# Altium schematic sheet 1_z003.schdoc
size 406 x 294 mm; Symbol: Altium_A3; Device: Altium_A3
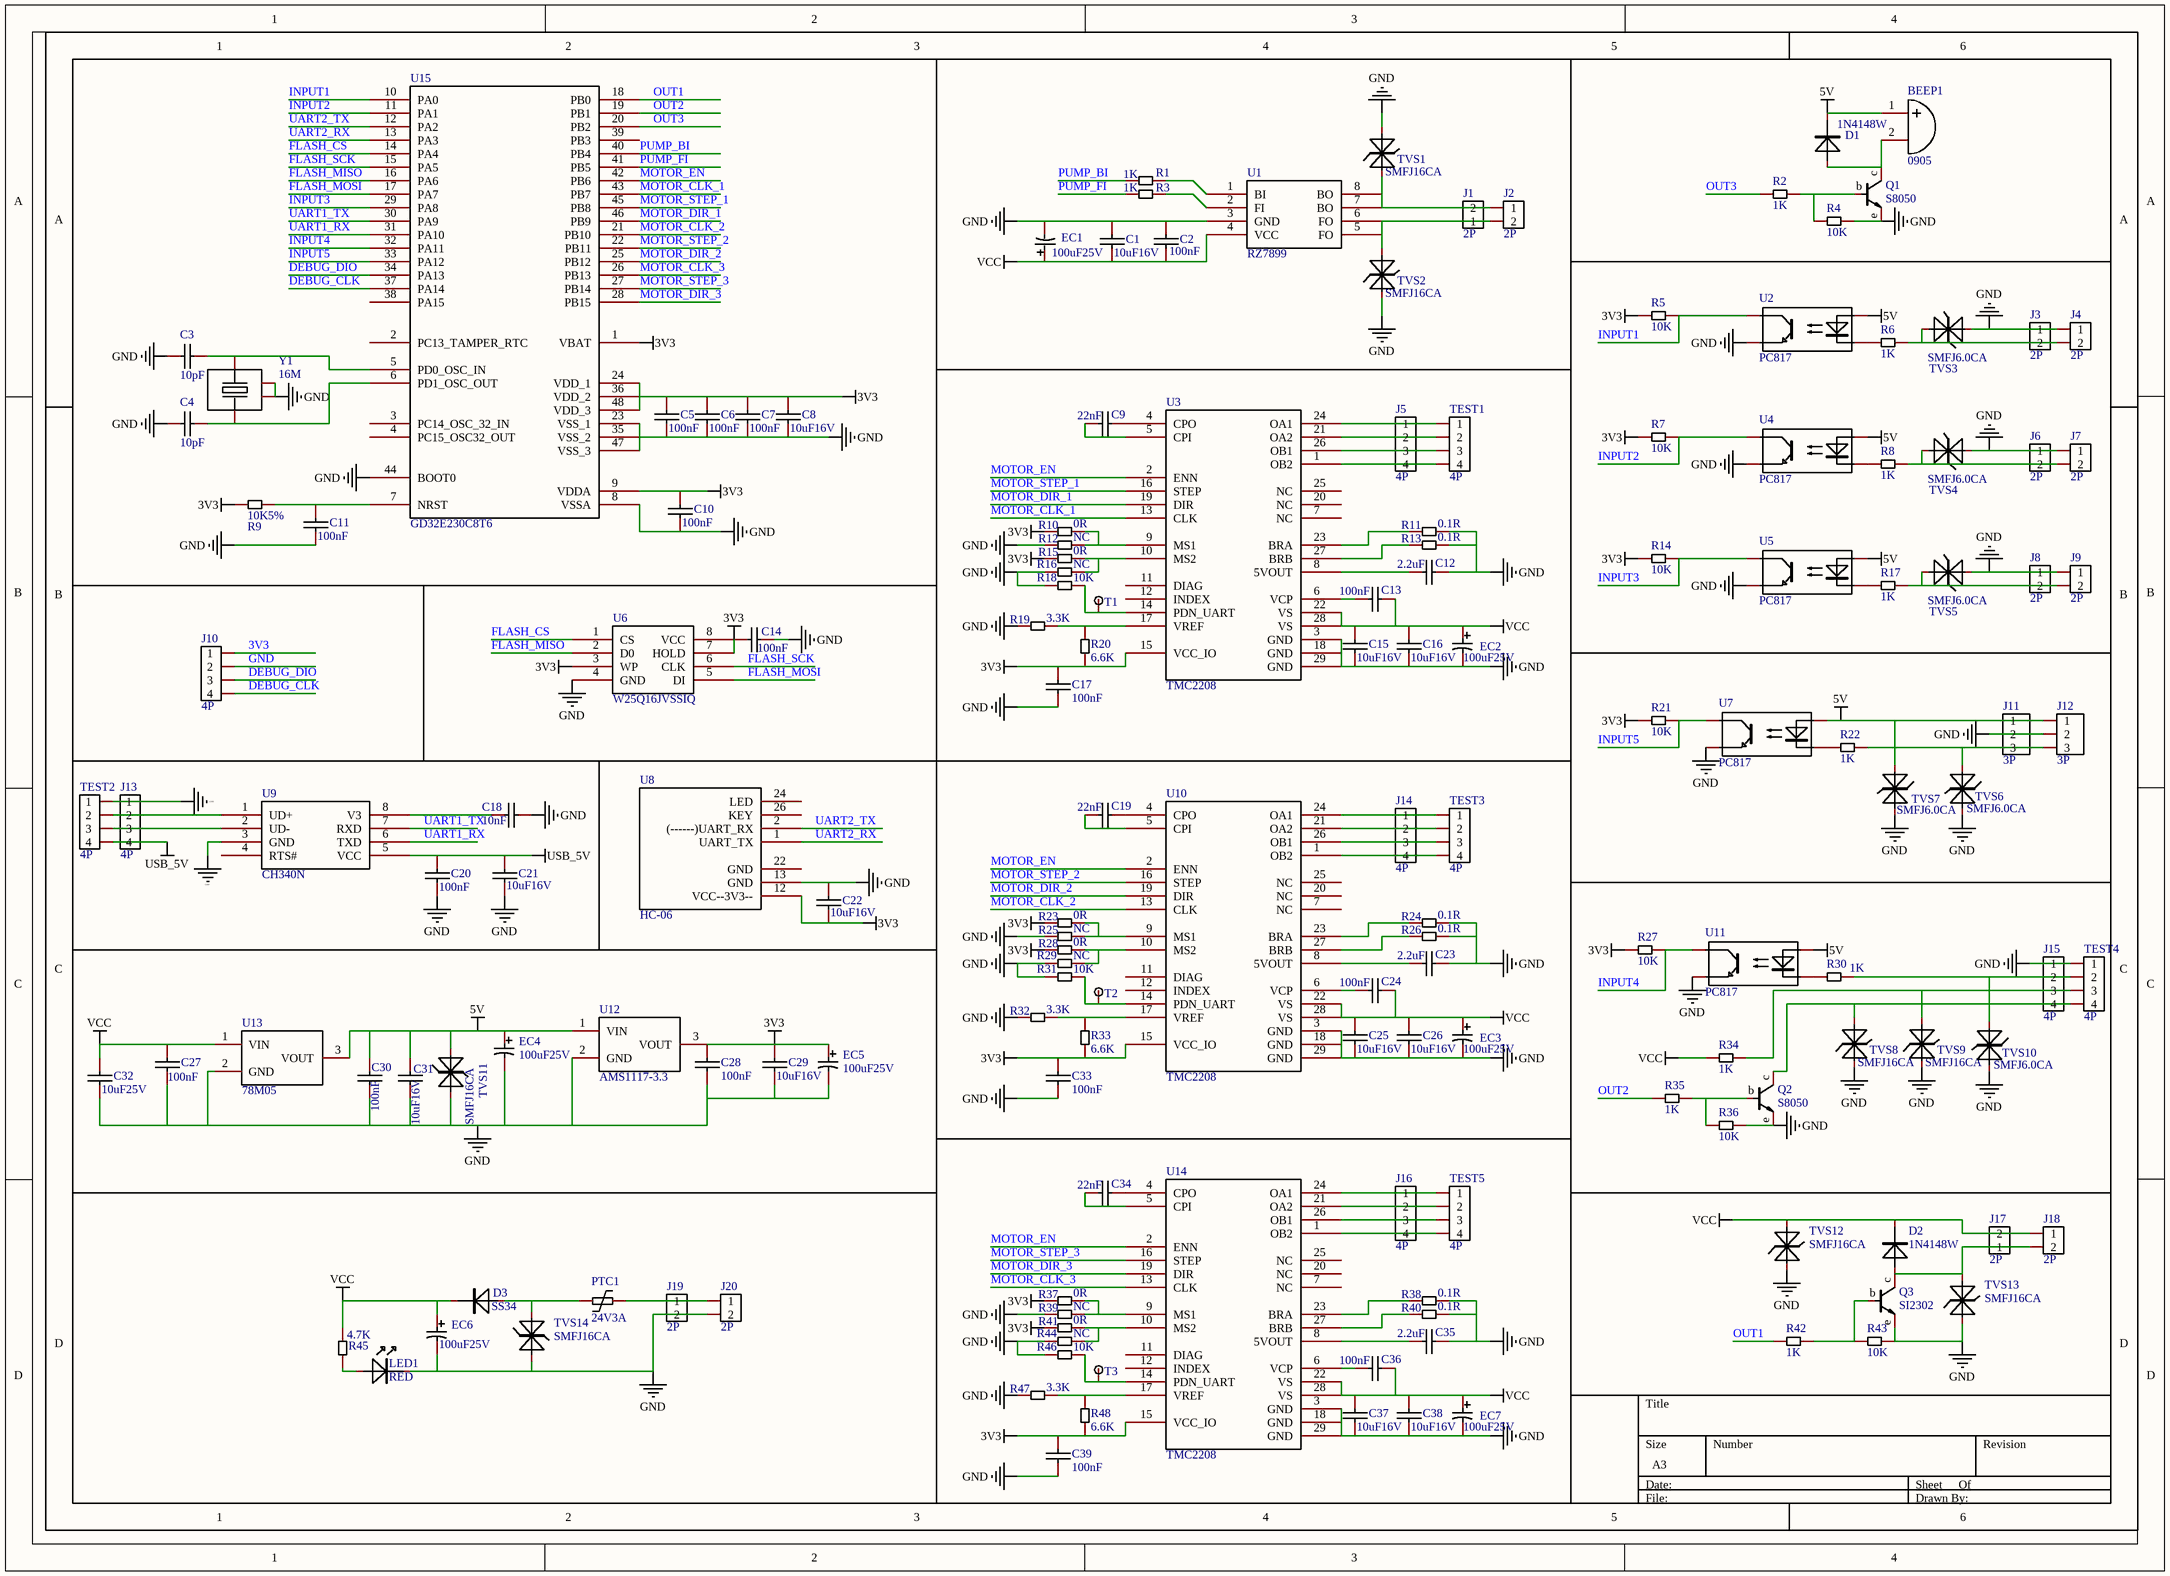
[diagram p0: 1_z003.schdoc]

## Parts
BEEP1  0905  [Դ 9*5mm]
C1  10uF16V  [0603C]
C2  100nF  [0603C]
C3  10pF  [0603C]
C4  10pF  [0603C]
C5  100nF  [0603C]
C6  100nF  [0603C]
C7  100nF  [0603C]
C8  10uF16V  [0603C]
C9  22nF  [0603C]
C10  100nF  [0603C]
C11  100nF  [0603C]
C12  2.2uF  [0603C]
C13  100nF  [0603C]
C14  100nF  [0603C]
C15  10uF16V  [0603C]
C16  10uF16V  [0603C]
C17  100nF  [0603C]
C18  10nF  [0603C]
C19  22nF  [0603C]
C20  100nF  [0603C]
C21  10uF16V  [0603C]
C22  10uF16V  [0603C]
C23  2.2uF  [0603C]
C24  100nF  [0603C]
C25  10uF16V  [0603C]
C26  10uF16V  [0603C]
C27  100nF  [0603C]
C28  100nF  [0603C]
C29  10uF16V  [0603C]
C30  100nF  [0603C]
C31  10uF16V  [0603C]
C32  10uF25V  [0805C]
C33  100nF  [0603C]
C34  22nF  [0603C]
C35  2.2uF  [0603C]
C36  100nF  [0603C]
C37  10uF16V  [0603C]
C38  10uF16V  [0603C]
C39  100nF  [0603C]
D1  1N4148W  [SOD-123]
D2  1N4148W  [SOD-123]
D3  SS34  [SMC]
EC1  100uF25V  [CAP-6.3*7.7]
EC2  100uF25V  [CAP-6.3*7.7]
EC3  100uF25V  [CAP-6.3*7.7]
EC4  100uF25V  [CAP-6.3*7.7]
EC5  100uF25V  [CAP-6.3*7.7]
EC6  100uF25V  [CAP-6.3*7.7]
EC7  100uF25V  [CAP-6.3*7.7]
J1  2P  [D-2.54-2P-G]
J2  2P  [D-2.54-2P-G]
J3  2P  [D-2.54-2P-G]
J4  2P  [D-2.54-2P-G]
J5  4P  [XH-2.54-4P-SMD-ʽ]
J6  2P  [D-2.54-2P-G]
J7  2P  [D-2.54-2P-G]
J8  2P  [D-2.54-2P-G]
J9  2P  [D-2.54-2P-G]
J10  4P  [XH-2.54-4P-SMD-ʽ]
J11  3P  [XH-2.54-3P-SMD-ʽ]
J12  3P  [XH-2.54-3P-SMD-ʽ]
J13  4P  [XH-2.54-4P-SMD-ʽ]
J14  4P  [XH-2.54-4P-SMD-ʽ]
J15  4P  [XH-2.54-4P-SMD-ʽ]
J16  4P  [XH-2.54-4P-SMD-ʽ]
J17  2P  [D-2.54-2P-G]
J18  2P  [D-2.54-2P-G]
J19  2P  [D-2.54-2P-G]
J20  2P  [D-2.54-2P-G]
LED1  RED  [0603D]
PTC1  24V3A  [1812R]
Q1  S8050  [SOT-23-BJT]
Q2  S8050  [SOT-23-BJT]
Q3  SI2302  [SOT-23-BJT]
R1  1K  [0603R]
R2  1K  [0603R]
R3  1K  [0603R]
R4  10K  [0603R]
R5  10K  [0603R]
R6  1K  [0603R]
R7  10K  [0603R]
R8  1K  [0603R]
R9  10K5%  [0603R]
R10  0R  [0603R]
R11  0.1R  [1206R]
R12  NC  [0603R]
R13  0.1R  [1206R]
R14  10K  [0603R]
R15  0R  [0603R]
R16  NC  [0603R]
R17  1K  [0603R]
R18  10K  [0603R]
R19  3.3K  [0603R]
R20  6.6K  [0603R]
R21  10K  [0603R]
R22  1K  [0603R]
R23  0R  [0603R]
R24  0.1R  [1206R]
R25  NC  [0603R]
R26  0.1R  [1206R]
R27  10K  [0603R]
R28  0R  [0603R]
R29  NC  [0603R]
R30  1K  [0603R]
R31  10K  [0603R]
R32  3.3K  [0603R]
R33  6.6K  [0603R]
R34  1K  [0603R]
R35  1K  [0603R]
R36  10K  [0603R]
R37  0R  [0603R]
R38  0.1R  [1206R]
R39  NC  [0603R]
R40  0.1R  [1206R]
R41  0R  [0603R]
R42  1K  [0603R]
R43  10K  [0603R]
R44  NC  [0603R]
R45  4.7K  [0603R]
R46  10K  [0603R]
R47  3.3K  [0603R]
R48  6.6K  [0603R]
T1  测试点  [Ե]  (value not drawn)
T2  测试点  [Ե]  (value not drawn)
T3  测试点  [Ե]  (value not drawn)
TEST1  4P  [XH-2.54-4P-SMD-ʽ]
TEST2  4P  [XH-2.54-4P-SMD-ʽ]
TEST3  4P  [XH-2.54-4P-SMD-ʽ]
TEST4  4P  [XH-2.54-4P-SMD-ʽ]
TEST5  4P  [XH-2.54-4P-SMD-ʽ]
TVS1  SMFJ16CA  [SOD-123]
TVS2  SMFJ16CA  [SOD-123]
TVS3  SMFJ6.0CA  [SOD-123]
TVS4  SMFJ6.0CA  [SOD-123]
TVS5  SMFJ6.0CA  [SOD-123]
TVS6  SMFJ6.0CA  [SOD-123]
TVS7  SMFJ6.0CA  [SOD-123]
TVS8  SMFJ16CA  [SOD-123]
TVS9  SMFJ16CA  [SOD-123]
TVS10  SMFJ6.0CA  [SOD-123]
TVS11  SMFJ16CA  [SOD-123]
TVS12  SMFJ16CA  [SOD-123]
TVS13  SMFJ16CA  [SOD-123]
TVS14  SMFJ16CA  [SOD-123]
U1  RZ7899  [SOP-8]
U2  PC817  [DIP-4-SMD]
U3  TMC2208  [QFN-28]
U4  PC817  [DIP-4-SMD]
U5  PC817  [DIP-4-SMD]
U6  W25Q16JVSSIQ  [SOIC-8]
U7  PC817  [DIP-4-SMD]
U8  HC-06  [HC-06]
U9  CH340N  [SOP-8]
U10  TMC2208  [QFN-28]
U11  PC817  [DIP-4-SMD]
U12  AMS1117-3.3  [SOT-223-4]
U13  78M05  [TO-252]
U14  TMC2208  [QFN-28]
U15  GD32E230C8T6  [LQFP-48]
Y1  16M  [XTAL-3225-4P]

## Nets
3V3: C5.2 C6.2 C7.2 C8.2 C10.2 C14.2 C17.1 C22.1 C28.1 C29.2 C33.1 C39.1 EC5.1 J10.1 R5.2 R7.2 R9.2 R10.2 R14.2 R15.2 R20.2 R21.2 R23.2 R27.2 R28.2 R33.2 R37.2 R41.2 R48.2 U3.15(VCC_IO) U6.3(WP) U6.7(HOLD) U6.8(VCC) U8.12(VCC--3V3--) U10.15(VCC_IO) U12.3(VOUT) U14.15(VCC_IO) U15.1(VBAT) U15.9(VDDA) U15.24(VDD_1) U15.36(VDD_2) U15.48(VDD_3)
5V: BEEP1.1 C30.1 C31.2 D1.2(K) EC4.1 J11.1 J12.1 TVS7.2(K) TVS11.2(K) U2.1(LED_Anode) U4.1(LED_Anode) U5.1(LED_Anode) U7.1(LED_Anode) U11.1(LED_Anode) U12.1(VIN) U13.3(VOUT)
GND: C1.2 C2.1 C3.2 C4.2 C5.1 C6.1 C7.1 C8.1 C10.1 C11.1 C12.1 C14.1 C15.1 C16.1 C17.2 C18.1 C20.1 C21.1 C22.2 C23.1 C25.1 C26.1 C27.2 C28.2 C29.1 C30.2 C31.1 C32.1 C33.2 C35.1 C37.1 C38.1 C39.2 EC1.2 EC2.2 EC3.2 EC4.2 EC5.2 EC6.2 EC7.2 J3.1 J4.1 J6.1 J7.1 J8.1 J9.1 J10.2 J11.2 J12.2 J13.1 J15.1 J19.2 J20.2 LED1.2 Q1.e Q2.e Q3.e R4.1 R11.1 R12.2 R13.1 R16.2 R18.2 R19.2 R24.1 R25.2 R26.1 R29.2 R31.2 R32.2 R36.1 R38.1 R39.2 R40.1 R43.1 R44.2 R46.2 R47.2 TEST2.1 TEST4.1 TVS1.1(A) TVS2.2(K) TVS3.2(K) TVS4.2(K) TVS5.2(K) TVS6.1(A) TVS7.1(A) TVS8.2(K) TVS9.2(K) TVS10.1(A) TVS11.1(A) TVS12.2(K) TVS13.2(K) TVS14.1(A) U1.3(GND) U2.3(Emitter) U3.3(GND) U3.18(GND) U3.29(GND) U4.3(Emitter) U5.3(Emitter) U6.4(GND) U7.3(Emitter) U8.13(GND) U9.3(GND) U10.3(GND) U10.18(GND) U10.29(GND) U11.3(Emitter) U12.2(GND) U13.2(GND) U14.3(GND) U14.18(GND) U14.29(GND) U15.8(VSSA) U15.23(VSS_1) U15.35(VSS_2) U15.44(BOOT0) U15.47(VSS_3) Y1.2 Y1.4
USB_5V: C20.2 C21.2 J13.4 TEST2.4 U9.5(VCC)
VCC: C1.1 C2.2 C13.1 C15.2 C16.2 C24.1 C25.2 C26.2 C27.1 C32.2 C36.1 C37.2 C38.2 D2.2(K) D3.2(K) EC1.1 EC2.1 EC3.1 EC6.1 EC7.1 J17.2 J18.1 R34.2 R45.2 TVS12.1(A) U1.4(VCC) U3.22(VS) U3.28(VS) U10.22(VS) U10.28(VS) U13.1(VIN) U14.22(VS) U14.28(VS)
DEBUG_CLK: J10.4 U15.37(PA14)
DEBUG_DIO: J10.3 U15.34(PA13)
FLASH_CS: U6.1(CS) U15.14(PA4)
FLASH_MISO: U6.2(D0) U15.16(PA6)
FLASH_MOSI: U6.5(DI) U15.17(PA7)
FLASH_SCK: U6.6(CLK) U15.15(PA5)
INPUT1: R5.1 U2.4(Collector) U15.10(PA0)
INPUT2: R7.1 U4.4(Collector) U15.11(PA1)
INPUT3: R14.1 U5.4(Collector) U15.29(PA8)
INPUT4: R27.1 U11.4(Collector) U15.32(PA11)
INPUT5: R21.1 U7.4(Collector) U15.33(PA12)
MOTOR_CLK_1: U3.13(CLK) U15.43(PB7)
MOTOR_CLK_2: U10.13(CLK) U15.21(PB10)
MOTOR_CLK_3: U14.13(CLK) U15.26(PB13)
MOTOR_DIR_1: U3.19(DIR) U15.46(PB9)
MOTOR_DIR_2: U10.19(DIR) U15.25(PB12)
MOTOR_DIR_3: U14.19(DIR) U15.28(PB15)
MOTOR_EN: U3.2(ENN) U10.2(ENN) U14.2(ENN) U15.42(PB6)
MOTOR_STEP_1: U3.16(STEP) U15.45(PB8)
MOTOR_STEP_2: U10.16(STEP) U15.22(PB11)
MOTOR_STEP_3: U14.16(STEP) U15.27(PB14)
OUT1: R42.2 U15.18(PB0)
OUT2: R35.2 U15.19(PB1)
OUT3: R2.2 U15.20(PB2)
PUMP_BI: R1.1 U15.40(PB4)
PUMP_FI: R3.1 U15.41(PB5)
UART1_RX: U9.6(TXD) U15.31(PA10)
UART1_TX: U9.7(RXD) U15.30(PA9)
UART2_RX: U8.1(UART_TX) U15.13(PA3)
UART2_TX: U8.2((------)UART_RX) U15.12(PA2)
NetBEEP1_2: BEEP1.2 D1.1(A) Q1.c
NetC3_1: C3.1 U15.5(PD0_OSC_IN) Y1.1
NetC4_1: C4.1 U15.6(PD1_OSC_OUT) Y1.3
NetC9_1: C9.1 U3.4(CPO)
NetC9_2: C9.2 U3.5(CPI)
NetC11_2: C11.2 R9.1 U15.7(NRST)
NetC12_2: C12.2 U3.8(5VOUT)
NetC13_2: C13.2 U3.6(VCP)
NetC18_2: C18.2 U9.8(V3)
NetC19_1: C19.1 U10.4(CPO)
NetC19_2: C19.2 U10.5(CPI)
NetC23_2: C23.2 U10.8(5VOUT)
NetC24_2: C24.2 U10.6(VCP)
NetC34_1: C34.1 U14.4(CPO)
NetC34_2: C34.2 U14.5(CPI)
NetC35_2: C35.2 U14.8(5VOUT)
NetC36_2: C36.2 U14.6(VCP)
NetD2_1: D2.1(A) J17.1 J18.2 Q3.c TVS13.1(A)
NetD3_1: D3.1(A) PTC1.2 TVS14.2(K)
NetJ1_1: J1.1 J2.2 TVS2.1(A) U1.5(FO) U1.6(FO)
NetJ1_2: J1.2 J2.1 TVS1.2(K) U1.7(BO) U1.8(BO)
NetJ3_2: J3.2 J4.2 R6.1 TVS3.1(A)
NetJ5_1: J5.1 TEST1.1 U3.24(OA1)
NetJ5_2: J5.2 TEST1.2 U3.21(OA2)
NetJ5_3: J5.3 TEST1.3 U3.26(OB1)
NetJ5_4: J5.4 TEST1.4 U3.1(OB2)
NetJ6_2: J6.2 J7.2 R8.1 TVS4.1(A)
NetJ8_2: J8.2 J9.2 R17.1 TVS5.1(A)
NetJ11_3: J11.3 J12.3 R22.1 TVS6.2(K)
NetJ13_2: J13.2 TEST2.2 U9.1(UD+)
NetJ13_3: J13.3 TEST2.3 U9.2(UD-)
NetJ14_1: J14.1 TEST3.1 U10.24(OA1)
NetJ14_2: J14.2 TEST3.2 U10.21(OA2)
NetJ14_3: J14.3 TEST3.3 U10.26(OB1)
NetJ14_4: J14.4 TEST3.4 U10.1(OB2)
NetJ15_2: J15.2 R30.1 TEST4.2 TVS10.2(K)
NetJ15_3: J15.3 R34.1 TEST4.3 TVS9.1(A)
NetJ15_4: J15.4 Q2.c TEST4.4 TVS8.1(A)
NetJ16_1: J16.1 TEST5.1 U14.24(OA1)
NetJ16_2: J16.2 TEST5.2 U14.21(OA2)
NetJ16_3: J16.3 TEST5.3 U14.26(OB1)
NetJ16_4: J16.4 TEST5.4 U14.1(OB2)
NetJ19_1: J19.1 J20.1 PTC1.1
NetLED1_1: LED1.1 R45.1
NetQ1_b: Q1.b R2.1 R4.2
NetQ2_b: Q2.b R35.1 R36.2
NetQ3_b: Q3.b R42.1 R43.2
NetR1_2: R1.2 U1.1(BI)
NetR3_2: R3.2 U1.2(FI)
NetR6_2: R6.2 U2.2(LED_Cathode)
NetR8_2: R8.2 U4.2(LED_Cathode)
NetR10_1: R10.1 R12.1 U3.9(MS1)
NetR11_2: R11.2 U3.23(BRA)
NetR13_2: R13.2 U3.27(BRB)
NetR15_1: R15.1 R16.1 U3.10(MS2)
NetR17_2: R17.2 U5.2(LED_Cathode)
NetR18_1: R18.1 T1.1 U3.14(PDN_UART)
NetR19_1: R19.1 R20.1 U3.17(VREF)
NetR22_2: R22.2 U7.2(LED_Cathode)
NetR23_1: R23.1 R25.1 U10.9(MS1)
NetR24_2: R24.2 U10.23(BRA)
NetR26_2: R26.2 U10.27(BRB)
NetR28_1: R28.1 R29.1 U10.10(MS2)
NetR30_2: R30.2 U11.2(LED_Cathode)
NetR31_1: R31.1 T2.1 U10.14(PDN_UART)
NetR32_1: R32.1 R33.1 U10.17(VREF)
NetR37_1: R37.1 R39.1 U14.9(MS1)
NetR38_2: R38.2 U14.23(BRA)
NetR40_2: R40.2 U14.27(BRB)
NetR41_1: R41.1 R44.1 U14.10(MS2)
NetR46_1: R46.1 T3.1 U14.14(PDN_UART)
NetR47_1: R47.1 R48.1 U14.17(VREF)

Not connected (* = marked no-connect by the designer): U3 7(NC) 11(DIAG) 12(INDEX) 20(NC) 25(NC); U8 22(GND) 24(LED) 26(KEY); U9 4(RTS#); U10 7(NC) 11(DIAG) 12(INDEX) 20(NC) 25(NC); U14 7(NC) 11(DIAG) 12(INDEX) 20(NC) 25(NC); U15 2(PC13_TAMPER_RTC) 3(PC14_OSC_32_IN) 4(PC15_OSC32_OUT) 38(PA15) 39(PB3)

## Notes on the sheet
- 1
- 2
- 3
- 4
- 5
- 6
- A
- B
- C
- D
- Title
- Size
- A3
- Number
- Revision
- File:
- Date:
- Drawn By:
- Sheet
- Of

## Library data of the parts
BEEP1 = 0905: Symbol: autoName_994cb5eb6fb58144; Origin Footprint 2: __Դ______-SMD-4*4; Origin Footprint 3: ______-SMD-4*4; Origin Footprint 4: ______-SMD-9.6*9.6*5; Add into BOM: yes; Origin Footprint 1: __Դ______ 9*5mm; Name: 0905; Device: 0905; Convert to PCB: yes; Design Item ID: ------; Library Name: -ǳ---Ԫ--
C1 C8 C15 C16 C25 C26 C29 C31 C37 C38 = 10uF16V: CAP-50V-X7R; Symbol: -޼-2P; Origin Footprint 2: 0805C; Origin Footprint 3: 0402C; Origin Footprint 4: 0201C; Origin Footprint 5: 1206C; Origin Footprint 6: 1210C; Origin Footprint 7: 1812C; Origin Footprint 8: 2010C; Origin Footprint 9: 2512C; Origin Footprint 10: CBB W=11.5 T=5 P=10; Origin Footprint 11: Y TYPE CAP D=10mm; Add into BOM: yes; Name: 10uF16V; Device: 10uF16V; Convert to PCB: yes; Origin Footprint 1: 0603C; Design Item ID: ------޼----2P; Library Name: ----Ԫ--
C2 C5-C7 C10 C11 C13 C14 C17 C20 C24 C27 C28 C30 C33 C36 C39 = 100nF: CAP-50V-X7R; Symbol: -޼-2P; Origin Footprint 2: 0805C; Origin Footprint 3: 0402C; Origin Footprint 4: 0201C; Origin Footprint 5: 1206C; Origin Footprint 6: 1210C; Origin Footprint 7: 1812C; Origin Footprint 8: 2010C; Origin Footprint 9: 2512C; Add into BOM: yes; Name: 100nF; Device: 100nF; Convert to PCB: yes; Origin Footprint 1: 0603C; Design Item ID: ------޼----2P; Library Name: ----Ԫ--
  C27 C28 C30: _ͺ_: *; ____: *
C3 C4 = 10pF: CAP-50V-X7R; Symbol: -޼-2P; Origin Footprint 2: 0805C; Origin Footprint 3: 0402C; Origin Footprint 4: 0201C; Origin Footprint 5: 1206C; Origin Footprint 6: 1210C; Origin Footprint 7: 1812C; Origin Footprint 8: 2010C; Origin Footprint 9: 2512C; Add into BOM: yes; Name: 10pF; Device: 10pF; Convert to PCB: yes; Origin Footprint 1: 0603C; Design Item ID: ------޼----2P; Library Name: ----Ԫ--
C9 C19 C34 = 22nF: CAP-50V-X7R; Symbol: -޼-2P; Origin Footprint 2: 0805C; Origin Footprint 3: 0402C; Origin Footprint 4: 0201C; Origin Footprint 5: 1206C; Origin Footprint 6: 1210C; Origin Footprint 7: 1812C; Origin Footprint 8: 2010C; Origin Footprint 9: 2512C; Add into BOM: yes; Name: 22nF; Device: 22nF; Convert to PCB: yes; Origin Footprint 1: 0603C; Design Item ID: ------޼----2P; Library Name: ----Ԫ--
C12 C23 C35 = 2.2uF: CAP-50V-X7R; Symbol: -޼-2P; Origin Footprint 2: 0805C; Origin Footprint 3: 0402C; Origin Footprint 4: 0201C; Origin Footprint 5: 1206C; Origin Footprint 6: 1210C; Origin Footprint 7: 1812C; Origin Footprint 8: 2010C; Origin Footprint 9: 2512C; Add into BOM: yes; Name: 2.2uF; Device: 2.2uF; Convert to PCB: yes; Origin Footprint 1: 0603C; Design Item ID: ------޼----2P; Library Name: ----Ԫ--
C18 = 10nF: CAP-50V-X7R; Symbol: -޼-2P; Origin Footprint 2: 0805C; Origin Footprint 3: 0402C; Origin Footprint 4: 0201C; Origin Footprint 5: 1206C; Origin Footprint 6: 1210C; Origin Footprint 7: 1812C; Origin Footprint 8: 2010C; Origin Footprint 9: 2512C; Add into BOM: yes; Name: 10nF; Device: 10nF; Convert to PCB: yes; Origin Footprint 1: 0603C; Design Item ID: ------޼----2P; Library Name: ----Ԫ--
C21 C22 = 10uF16V: Symbol: -޼-2P; Origin Footprint 2: 0805C; Origin Footprint 3: 0402C; Origin Footprint 4: 0201C; Origin Footprint 5: 1206C; Origin Footprint 6: 1210C; Origin Footprint 7: 1812C; Origin Footprint 8: 2010C; Origin Footprint 9: 2512C; Origin Footprint 10: CBB W=11.5 T=5 P=10; Origin Footprint 11: Y TYPE CAP D=10mm; Add into BOM: yes; Name: 10uF16V; Device: 10uF16V; Convert to PCB: yes; Origin Footprint 1: 0603C; Design Item ID: ------޼----2P; Library Name: ----Ԫ--
C32 = 10uF25V: CAP-50V-X7R; Symbol: -޼-2P; Origin Footprint 2: 0603C; Origin Footprint 3: 0402C; Origin Footprint 4: 0201C; Origin Footprint 5: 1206C; Origin Footprint 6: 1210C; Origin Footprint 7: 1812C; Origin Footprint 8: 2010C; Origin Footprint 9: 2512C; Add into BOM: yes; Name: 10uF25V; Device: 10uF25V; Convert to PCB: yes; Origin Footprint 1: 0805C; Design Item ID: ------޼----2P; Library Name: ----Ԫ--
D1 D2 = 1N4148W: Symbol: -ͨ-2P; Origin Footprint 2: 1206D; Origin Footprint 3: SMA; Origin Footprint 4: SMB; Origin Footprint 5: SMC; Origin Footprint 6: TO-277; Origin Footprint 7: 0805D; Origin Footprint 8: SOD-923; Origin Footprint 9: LL34; Add into BOM: yes; Name: 1N4148W; Device: 1N4148W; Convert to PCB: yes; Origin Footprint 1: SOD-123; Design Item ID: ---------ͨ-2P; Library Name: ----Ԫ--
D3 = SS34: Symbol: -ͨ-2P; Origin Footprint 2: 1206D; Origin Footprint 3: SMA; Origin Footprint 4: SMB; Origin Footprint 5: TO-277; Origin Footprint 6: 0805D; Origin Footprint 7: SOD-123; Add into BOM: yes; Name: SS34; Device: SS34; Convert to PCB: yes; Origin Footprint 1: SMC; Design Item ID: ---------ͨ-2P; Library Name: ----Ԫ--
EC1-EC7 = 100uF25V: Symbol: -Ե-2P; Origin Footprint 2: CAP-10*12.6; Origin Footprint 3: CAP-8.0*6.9; Origin Footprint 4: CAP-4.0*5.4; Origin Footprint 5: XH414H-IV01E; Origin Footprint 6: CAP_DIP_5*11; Origin Footprint 7: CAP_DIP_6.3*11; Origin Footprint 8: CAP_DIP_8*12; Origin Footprint 9: CAP_DIP_10*16; Origin Footprint 10: CAP_DIP_10*20; Origin Footprint 11: CAP_DIP_12.5*20; Origin Footprint 12: CAP_DIP_12.5*25; Origin Footprint 13: CAP_DIP_12.5*30; Origin Footprint 14: CAP_DIP_16*25; Origin Footprint 15: CAP_DIP_16*30; Origin Footprint 16: CAP_DIP_16*35; Origin Footprint 17: CAP_DIP_16*40; Origin Footprint 18: CAP_DIP_18*35; Origin Footprint 19: CAP_DIP_18*40; Origin Footprint 20: CAP_DIP_18*45; Origin Footprint 21: CAP-5.0*5.9; Origin Footprint 22: TA; Origin Footprint 23: TB; Origin Footprint 24: TC; Origin Footprint 25: TD; Origin Footprint 26: TP; Origin Footprint 27: CAP_DIP_30*35; Add into BOM: yes; Name: 100uF25V; Device: 100uF25V; Convert to PCB: yes; Origin Footprint 1: CAP-6.3*7.7; Design Item ID: --------Ե----2P; Library Name: ----Ԫ--
J1 J3 J6 J8 J17 J19 = 2P: Origin Footprint 2: HT5.08-2P; Origin Footprint 4: 5.08-2P; Origin Footprint 5: XH-2.54-2P; Origin Footprint 6: HX-PT-2.0-2P; Origin Footprint 7: XT-60-M; Origin Footprint 8: XT-60-G; Origin Footprint 9: SMD-1.25mm-2P; Origin Footprint 10: SH1.0-2P-____; Origin Footprint 11: PH-2.0-2P-____; Origin Footprint 12: PH-2.0-2P-ֱ__; Origin Footprint 13: VH-7.92-2P; Origin Footprint 14: D-2.0-2P-G; Origin Footprint 15: MAX3.96-2P; Add into BOM: yes; Origin Footprint 1: XH-2.54-2P-SMD-__ʽ; Name: 2P; Symbol: 2P; Device: 2P; Origin Footprint 3: D-2.54-2P-G; Convert to PCB: yes; Design Item ID: 2P; Library Name: ----
J2 J4 J7 J9 J18 J20 = 2P: Origin Footprint 2: HT5.08-2P; Origin Footprint 3: 5.08-2P; Origin Footprint 4: XH-2.54-2P; Origin Footprint 5: HX-PT-2.0-2P; Origin Footprint 6: XT-60-M; Origin Footprint 7: XT-60-G; Origin Footprint 8: SMD-1.25mm-2P; Origin Footprint 9: XH-2.54-2P-SMD-__ʽ; Origin Footprint 10: SH1.0-2P-____; Origin Footprint 11: PH-2.0-2P-____; Origin Footprint 12: PH-2.0-2P-ֱ__; Origin Footprint 13: VH-7.92-2P; Origin Footprint 14: D-2.0-2P-G; Origin Footprint 15: MAX3.96-2P; Add into BOM: yes; Name: 2P; Symbol: 2P; Device: 2P; Convert to PCB: yes; Origin Footprint 1: D-2.54-2P-G; Design Item ID: 2P; Library Name: ----
J5 J13-J16 = 4P: Origin Footprint 2: D-2.54-4P-G; Origin Footprint 3: 5.08-4P; Origin Footprint 4: XH-2.54-4P; Origin Footprint 5: HT5.08-4P; Origin Footprint 6: HT5.08-4P-GD; Origin Footprint 7: HX-PT-2.0-4P; Origin Footprint 8: SH1.0_4P___ʽ; Origin Footprint 9: D-2.0-4P-G; Origin Footprint 10: SH1.0-4P-____; Origin Footprint 11: FFC-1.25-4P; Origin Footprint 12: PH-2.0-4P-____; Origin Footprint 13: PH-2.0-4P-ֱ__; Origin Footprint 14: VH-3.96-4P; Origin Footprint 15: ̽__-SMD-4P; Add into BOM: yes; Origin Footprint 1: XH-2.54-4P-SMD-__ʽ; Name: 4P; Symbol: 4P; Device: 4P; Convert to PCB: yes; Design Item ID: 4P; Library Name: ----
J10 TEST1-TEST5 = 4P: Origin Footprint 2: 5.08-4P; Origin Footprint 3: XH-2.54-4P; Origin Footprint 4: HT5.08-4P; Origin Footprint 5: HT5.08-4P-GD; Origin Footprint 6: HX-PT-2.0-4P; Origin Footprint 7: SH1.0_4P___ʽ; Origin Footprint 8: XH-2.54-4P-SMD-__ʽ; Origin Footprint 9: D-2.0-4P-G; Origin Footprint 10: SH1.0-4P-____; Origin Footprint 11: FFC-1.25-4P; Origin Footprint 12: PH-2.0-4P-____; Origin Footprint 13: PH-2.0-4P-ֱ__; Origin Footprint 14: VH-3.96-4P; Origin Footprint 15: ̽__-SMD-4P; Add into BOM: yes; Origin Footprint 1: D-2.54-4P-G; Name: 4P; Symbol: 4P; Device: 4P; Convert to PCB: yes; Design Item ID: 4P; Library Name: ----
J11 = 3P: Origin Footprint 2: HT5.08-3P; Origin Footprint 3: D-2.54-3P-G; Origin Footprint 4: 5.08-3P; Origin Footprint 5: XH-2.54-3P; Origin Footprint 6: HX-PT-2.0-3P; Origin Footprint 7: FFC-1.25-3P; Origin Footprint 8: VH-7.92-3P; Origin Footprint 9: PH-2.0-3P-ֱ__; Origin Footprint 10: SH1.0-3P-____; Origin Footprint 11: VH-3.96-3P; Add into BOM: yes; Origin Footprint 1: XH-2.54-3P-SMD-__ʽ; Name: 3P; Symbol: 3P; Device: 3P; Convert to PCB: yes; Design Item ID: 3P; Library Name: ----
J12 = 3P: Origin Footprint 2: HT5.08-3P; Origin Footprint 3: 5.08-3P; Origin Footprint 4: XH-2.54-3P; Origin Footprint 5: HX-PT-2.0-3P; Origin Footprint 6: XH-2.54-3P-SMD-__ʽ; Origin Footprint 7: FFC-1.25-3P; Origin Footprint 8: VH-7.92-3P; Origin Footprint 9: PH-2.0-3P-ֱ__; Origin Footprint 10: SH1.0-3P-____; Origin Footprint 11: VH-3.96-3P; Add into BOM: yes; Origin Footprint 1: D-2.54-3P-G; Name: 3P; Symbol: 3P; Device: 3P; Convert to PCB: yes; Design Item ID: 3P; Library Name: ----
LED1 = RED: Symbol: -LED-2P; Origin Footprint 2: 0805D; Origin Footprint 3: 0603D__ɫ; Origin Footprint 7: 5mm_LED; Origin Footprint 8: 10mm_LED; Origin Footprint 9: 0402D; Origin Footprint 10: 3mm_LED; Add into BOM: yes; Name: RED; Device: RED; Origin Footprint 4: 0603D__ɫ; Origin Footprint 5: 0603D__ɫ; Origin Footprint 6: 0603D__ɫ; Convert to PCB: yes; Origin Footprint 1: 0603D; Design Item ID: -------LED-2P; Library Name: ----Ԫ--
PTC1 = 24V3A: Symbol: ˿-Իָ-2P; Origin Footprint 2: 0805R; Origin Footprint 3: 1206R; Origin Footprint 4: 2010R; Origin Footprint 5: 2012R; Origin Footprint 6: 2512R; Origin Footprint 7: 0603R; Origin Footprint 8: B250-120; Origin Footprint 9: 1210R; Origin Footprint 10: MOV D9; Origin Footprint 11: MOV D5; Origin Footprint 12: MOV D7; Origin Footprint 13: MOV D11; Origin Footprint 14: MOV D13; Origin Footprint 15: MOV D14; Origin Footprint 16: MOV D15; Add into BOM: yes; Name: 24V3A; Device: 24V3A; Convert to PCB: yes; Origin Footprint 1: 1812R; Design Item ID: ----˿--Իָ--2P; Library Name: ----Ԫ--
Q1 Q2 = S8050: Symbol: -NPN-3P; Origin Footprint 2: SOT-89 -BJT; Origin Footprint 3: TO-220-BJT-TP15*10.5*21; Origin Footprint 4: TO-220-BJT; Add into BOM: yes; Name: S8050; Device: S8050; Convert to PCB: yes; Origin Footprint 1: SOT-23-BJT; Design Item ID: -------NPN-3P; Library Name: ----Ԫ--
Q3 = SI2302: Symbol: -NPN-3P; Origin Footprint 2: SOT-89 -BJT; Origin Footprint 3: TO-220-BJT-TP15*10.5*21; Origin Footprint 4: TO-220-BJT; Add into BOM: yes; Name: SI2302; Device: SI2302; Convert to PCB: yes; Origin Footprint 1: SOT-23-BJT; Design Item ID: -------NPN-3P; Library Name: ----Ԫ--
R1 R3 = 1K: RES-1%-RL; Symbol: -ͨ-2P; Origin Footprint 2: 0805R; Origin Footprint 3: 0402R; Origin Footprint 4: 0201R; Origin Footprint 5: 1206R; Origin Footprint 6: 1210R; Origin Footprint 7: 1812R; Origin Footprint 8: 2012R; Origin Footprint 9: 2512R; Add into BOM: yes; Origin Footprint 10: 5930R; Name: 1K; Device: 1K; _ͺ_: *; ____: *; Convert to PCB: yes; Origin Footprint 1: 0603R; Design Item ID: -------ͨ-2P; Library Name: ----Ԫ--
R2 R35 R42 = 1K: RES-1%-RL; Symbol: -ͨ-2P; Origin Footprint 2: 0805R; Origin Footprint 3: 0402R; Origin Footprint 4: 0201R; Origin Footprint 5: 1206R; Origin Footprint 6: 1210R; Origin Footprint 7: 1812R; Origin Footprint 8: 2012R; Origin Footprint 9: 2512R; Add into BOM: yes; Name: 1K; Device: 1K; _ͺ_: *; ____: *; Convert to PCB: yes; Origin Footprint 1: 0603R; Design Item ID: -------ͨ-2P; Library Name: ----Ԫ--
R4 R36 R43 = 10K: RES-1%-RL; Symbol: -ͨ-2P; Origin Footprint 2: 0805R; Origin Footprint 3: 0402R; Origin Footprint 4: 0201R; Origin Footprint 5: 1206R; Origin Footprint 6: 1210R; Origin Footprint 7: 1812R; Origin Footprint 8: 2012R; Origin Footprint 9: 2512R; Add into BOM: yes; Name: 10K; Device: 10K; _ͺ_: *; ____: *; Convert to PCB: yes; Origin Footprint 1: 0603R; Design Item ID: -------ͨ-2P; Library Name: ----Ԫ--
R5 R7 R14 R18 R21 R27 R31 R46 = 10K: --Ƭ----; Symbol: -ͨ-2P; Origin Footprint 2: 0805R; Origin Footprint 3: 0402R; Origin Footprint 4: 0201R; Origin Footprint 5: 1206R; Origin Footprint 6: 1210R; Origin Footprint 7: 1812R; Origin Footprint 8: 2012R; Origin Footprint 9: 2512R; Add into BOM: yes; Name: 10K; Device: 10K; _ͺ_: *; ____: *; Convert to PCB: yes; Origin Footprint 1: 0603R; Design Item ID: -------ͨ-2P; Library Name: ----Ԫ--
R6 R8 R17 R22 R30 R34 = 1K: --Ƭ----; Symbol: -ͨ-2P; Origin Footprint 2: 0805R; Origin Footprint 3: 0402R; Origin Footprint 4: 0201R; Origin Footprint 5: 1206R; Origin Footprint 6: 1210R; Origin Footprint 7: 1812R; Origin Footprint 8: 2012R; Origin Footprint 9: 2512R; Add into BOM: yes; Name: 1K; Device: 1K; _ͺ_: *; ____: *; Convert to PCB: yes; Origin Footprint 1: 0603R; Design Item ID: -------ͨ-2P; Library Name: ----Ԫ--
R9 = 10K5%: RES-1%-RL; Symbol: -ͨ-2P; Origin Footprint 2: 0805R; Origin Footprint 3: 0402R; Origin Footprint 4: 0201R; Origin Footprint 5: 1206R; Origin Footprint 6: 1210R; Origin Footprint 7: 1812R; Origin Footprint 8: 2012R; Origin Footprint 9: 2512R; Add into BOM: yes; Name: 10K5%; Device: 10K5%; Convert to PCB: yes; Origin Footprint 1: 0603R; Design Item ID: -------ͨ-2P; Library Name: ----Ԫ--
R10 R15 R23 R28 R37 R41 = 0R: --Ƭ----; Symbol: -ͨ-2P; Origin Footprint 2: 0805R; Origin Footprint 3: 0402R; Origin Footprint 4: 0201R; Origin Footprint 5: 1206R; Origin Footprint 6: 1210R; Origin Footprint 7: 1812R; Origin Footprint 8: 2012R; Origin Footprint 9: 2512R; Add into BOM: yes; Name: 0R; Device: 0R; _ͺ_: *; ____: *; Convert to PCB: yes; Origin Footprint 1: 0603R; Design Item ID: -------ͨ-2P; Library Name: ----Ԫ--
R11 R13 R24 R26 R38 R40 = 0.1R: --Ƭ----; Symbol: -ͨ-2P; Origin Footprint 2: 0805R; Origin Footprint 3: 0603R; Origin Footprint 4: 0402R; Origin Footprint 5: 0201R; Origin Footprint 6: 1210R; Origin Footprint 7: 1812R; Origin Footprint 8: 2012R; Origin Footprint 9: 2512R; Add into BOM: yes; Name: 0.1R; Device: 0.1R; _ͺ_: *; ____: *; Convert to PCB: yes; Origin Footprint 1: 1206R; Design Item ID: -------ͨ-2P; Library Name: ----Ԫ--
R12 R16 R25 R29 R39 R44 = NC: --Ƭ----; Symbol: -ͨ-2P; Origin Footprint 2: 0805R; Origin Footprint 3: 0402R; Origin Footprint 4: 0201R; Origin Footprint 5: 1206R; Origin Footprint 6: 1210R; Origin Footprint 7: 1812R; Origin Footprint 8: 2012R; Origin Footprint 9: 2512R; Add into BOM: yes; Name: NC; Device: NC; _ͺ_: *; ____: *; Convert to PCB: yes; Origin Footprint 1: 0603R; Design Item ID: -------ͨ-2P; Library Name: ----Ԫ--
R19 R32 R47 = 3.3K: --Ƭ----; Symbol: -ͨ-2P; Origin Footprint 2: 0805R; Origin Footprint 3: 0402R; Origin Footprint 4: 0201R; Origin Footprint 5: 1206R; Origin Footprint 6: 1210R; Origin Footprint 7: 1812R; Origin Footprint 8: 2012R; Origin Footprint 9: 2512R; Add into BOM: yes; Name: 3.3K; Device: 3.3K; _ͺ_: *; ____: *; Convert to PCB: yes; Origin Footprint 1: 0603R; Design Item ID: -------ͨ-2P; Library Name: ----Ԫ--
R20 R33 R48 = 6.6K: --Ƭ----; Symbol: -ͨ-2P; Origin Footprint 2: 0805R; Origin Footprint 3: 0402R; Origin Footprint 4: 0201R; Origin Footprint 5: 1206R; Origin Footprint 6: 1210R; Origin Footprint 7: 1812R; Origin Footprint 8: 2012R; Origin Footprint 9: 2512R; Add into BOM: yes; Name: 6.6K; Device: 6.6K; _ͺ_: *; ____: *; Convert to PCB: yes; Origin Footprint 1: 0603R; Design Item ID: -------ͨ-2P; Library Name: ----Ԫ--
R45 = 4.7K: --Ƭ----; Symbol: -ͨ-2P; Origin Footprint 2: 0805R; Origin Footprint 3: 0402R; Origin Footprint 4: 0201R; Origin Footprint 5: 1206R; Origin Footprint 6: 1210R; Origin Footprint 7: 1812R; Origin Footprint 8: 2012R; Origin Footprint 9: 2512R; Add into BOM: yes; Name: 4.7K; Device: 4.7K; _ͺ_: *; ____: *; Convert to PCB: yes; Origin Footprint 1: 0603R; Design Item ID: -------ͨ-2P; Library Name: ----Ԫ--
T1-T3 = 测试点: Add into BOM: yes; Origin Footprint: ___Ե_; Name: 测试点; Symbol: Ե; Device: 测试点; Convert to PCB: yes; Design Item ID: ---Ե-; Library Name: -ǳ---Ԫ--
TVS1 TVS2 TVS8 TVS9 TVS12 TVS13 = SMFJ16CA: Symbol: -˫TVS-2P; Origin Footprint 2: SMA; Origin Footprint 3: SMB; Origin Footprint 4: SMC; Origin Footprint 5: SOD-923; Origin Footprint 6: 0402R; Origin Footprint 7: 0603R; Add into BOM: yes; Origin Footprint 8: SOD-523; Name: SMFJ16CA; Device: SMFJ16CA; Convert to PCB: yes; Origin Footprint 1: SOD-123; Design Item ID: -------˫--TVS-2P; Library Name: ----Ԫ--
TVS3-TVS7 TVS10 = SMFJ6.0CA: Symbol: -˫TVS-2P; Origin Footprint 2: SMA; Origin Footprint 3: SMB; Origin Footprint 4: SMC; Origin Footprint 5: SOD-923; Origin Footprint 6: 0402R; Origin Footprint 7: 0603R; Origin Footprint 8: SOD-523; Add into BOM: yes; Name: SMFJ6.0CA; Device: SMFJ6.0CA; Convert to PCB: yes; Origin Footprint 1: SOD-123; Design Item ID: -------˫--TVS-2P; Library Name: ----Ԫ--
TVS11 TVS14 = SMFJ16CA: Symbol: -˫TVS-2P; Origin Footprint 2: SMA; Origin Footprint 3: SMB; Origin Footprint 4: SMC; Origin Footprint 5: SOD-923; Origin Footprint 6: 0402R; Origin Footprint 7: 0603R; Add into BOM: yes; Name: SMFJ16CA; Device: SMFJ16CA; Convert to PCB: yes; Origin Footprint 1: SOD-123; Design Item ID: -------˫--TVS-2P; Library Name: ----Ԫ--
U1 = RZ7899: Add into BOM: yes; Name: RZ7899; Symbol: RZ7899; Device: RZ7899; Convert to PCB: yes; Origin Footprint: SOP-8; Design Item ID: RZ7899; Library Name: IC
U2 U4 U5 U7 U11 = PC817: Origin Footprint 2: DIP-4; Add into BOM: yes; Name: PC817; Symbol: PC817; Device: PC817; Convert to PCB: yes; Origin Footprint 1: DIP-4-SMD; Design Item ID: PC817; Library Name: IC
U3 U10 U14 = TMC2208: Add into BOM: yes; Name: TMC2208; Symbol: TMC2208; Device: TMC2208; Convert to PCB: yes; Origin Footprint: QFN-28; Design Item ID: TMC2208; Library Name: IC; NO_CONNECT: yes
U6 = W25Q16JVSSIQ: Symbol: W25QXXXX; Add into BOM: yes; Origin Footprint: SOIC-8 ____; Name: W25Q16JVSSIQ; Device: W25Q16JVSSIQ; Convert to PCB: yes; Design Item ID: W25QXXXX; Library Name: IC
U8 = HC-06: Add into BOM: yes; Name: HC-06; Symbol: HC-06; Device: HC-06; Convert to PCB: yes; Origin Footprint: HC-06; Design Item ID: HC-06; Library Name: -ǳ---Ԫ--; NO_CONNECT: yes
U9 = CH340N: Add into BOM: yes; Name: CH340N; Symbol: CH340N; Device: CH340N; Convert to PCB: yes; Origin Footprint: SOP-8; Design Item ID: CH340N; Library Name: IC; NO_CONNECT: yes
U12 = AMS1117-3.3: Symbol: AMS1117-3.3/5.0; Origin Footprint 2: SOT-89; Add into BOM: yes; Name: AMS1117-3.3; Device: AMS1117-3.3; Convert to PCB: yes; Origin Footprint 1: SOT-223-4; Design Item ID: AMS1117-3.3/5.0; Library Name: IC
U13 = 78M05: Add into BOM: yes; Name: 78M05; Symbol: 78M05; Device: 78M05; Convert to PCB: yes; Origin Footprint: TO-252; Design Item ID: 78M05; Library Name: IC
U15 = GD32E230C8T6: Symbol: STM32F103C8T6; Add into BOM: yes; Name: GD32E230C8T6; Device: GD32E230C8T6; Convert to PCB: yes; Origin Footprint: LQFP-48; Design Item ID: STM32F103C8T6; Library Name: IC; NO_CONNECT: yes
Y1 = 16M: Symbol: -Դ-4P; Origin Footprint 2: XTAL-7050-4P; Origin Footprint 3: XTAL-5032-4P; Origin Footprint 4: XTAL-2016-4P; Origin Footprint 5: XTAL-1612-4P; Add into BOM: yes; Name: 16M; Device: 16M; Convert to PCB: yes; Origin Footprint 1: XTAL-3225-4P; Design Item ID: -------Դ-4P; Library Name: ----Ԫ--